# EasyEDA schematic Lightsaber.json
TITLE: Sheet_1; REV: 1.0; Date: 2024-11-18; Sheet: 1/1; Company: Your Company
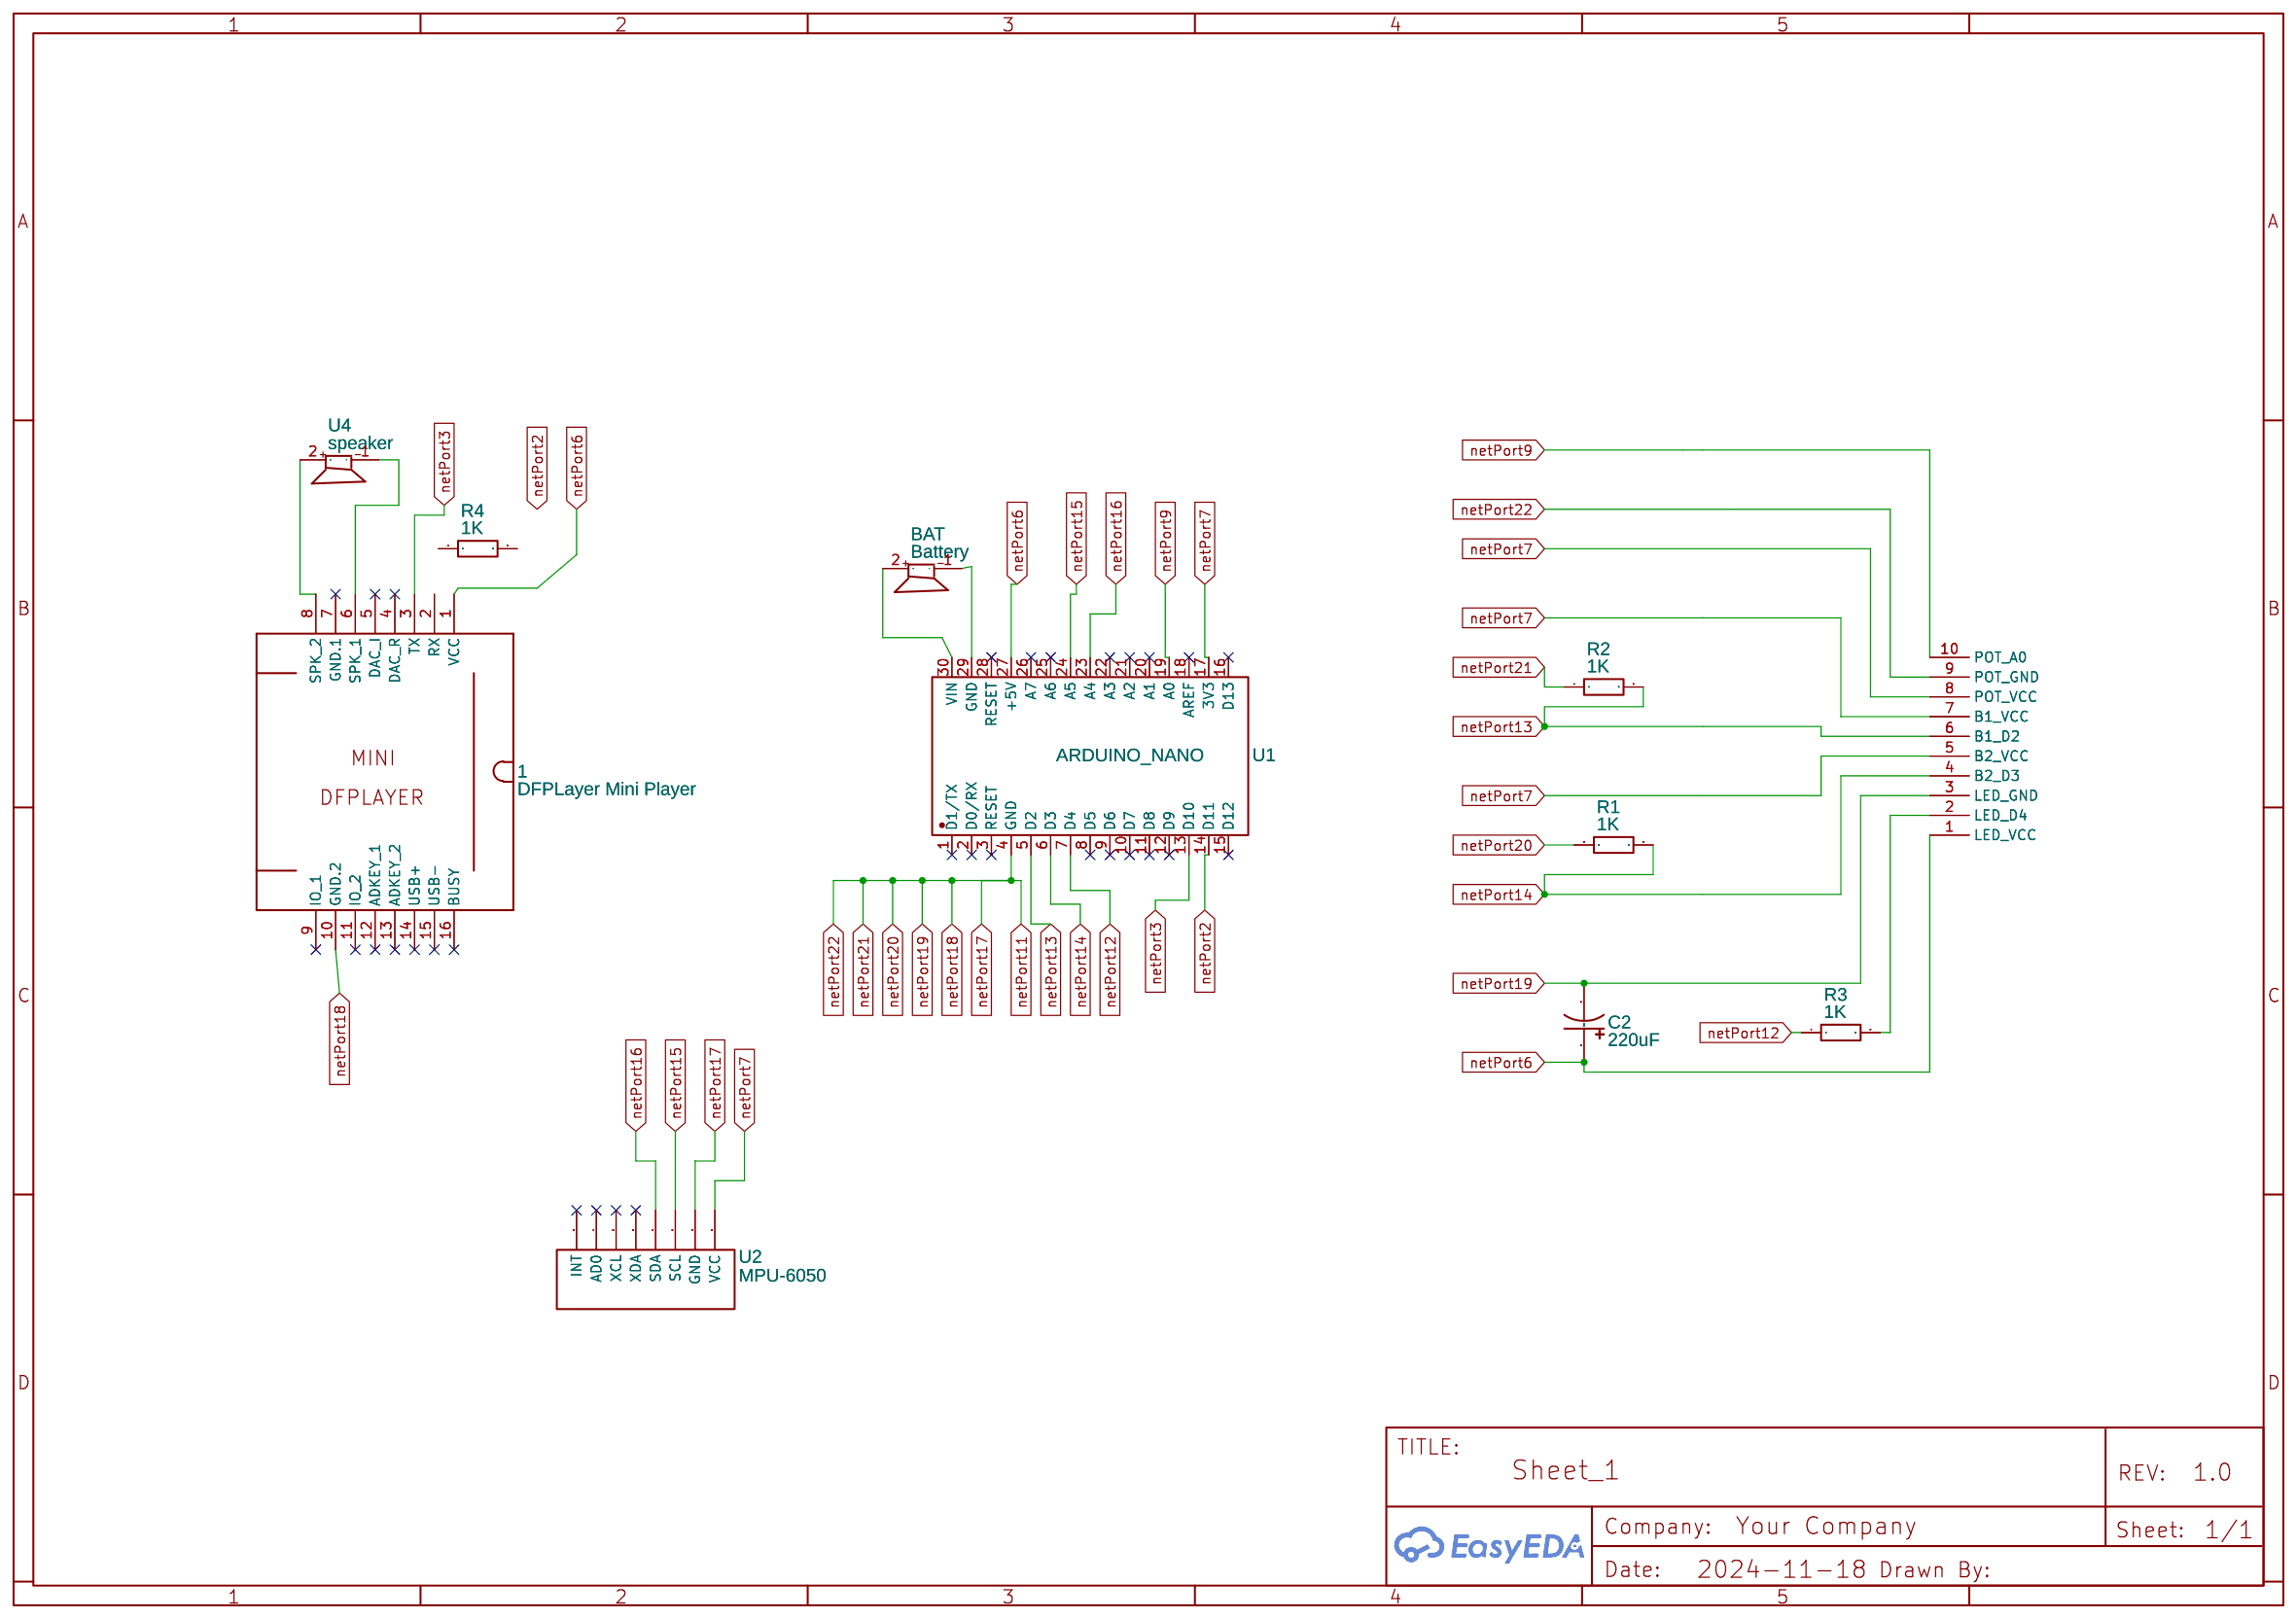
[diagram p0: schematic sheet]

## Parts
1  DFPLayer Mini Player  [DFPLAYER-MINI-MODULE]
BAT  Battery  [SPEAKER]
C2  220uF  [CAPACITOR 220UF @ 16V]
P1  10 pins  [10PINS]
R1  1K  [REZISTOR-0.125_WT_K]
R2  1K  [REZISTOR-0.125_WT_K]
R3  1K  [REZISTOR-0.125_WT_K]
R4  1K  [REZISTOR-0.125_WT_K]
U1  ARDUINO_NANO  [COMM-TH_ARDUINO_NANO]
U2  MPU-6050  [MPU-6050]
U4  speaker  [SPEAKER]

## Library data of the parts
1 = DFPLayer Mini Player: Contributor: santer-88; Supplier: DFPlayer; Supplier Part: DFPlayer; Manufacturer: DFP
BAT U4 = speaker: Contributor: daphnequinonesladroma
C2 = capacitor 220uF @ 16V: Contributor: jorgeca
P1 = 10 pins: Manufacturer Part: New SchematicLib; Contributor: lichat
R1-R4 = 0.125Wt_d: Manufacturer Part: 0.125Wt_k; Supplier Part: undefined; Contributor: titusmarin
U1 = ARDUINO_NANO: Contributor: lcsc; Supplier: LCSC; Supplier Part: C9900017879; Manufacturer: null; JLCPCB Part Class: Extended Part
U2 = MPU-6050: Supplier Part: undefined; Contributor: Tiago Ferreira

## Nets
netPort2: U1.14(D11)
netPort3: 1.3(TX) U1.13(D10)
netPort6: 1.1(VCC) C2.1 P1.1(LED_VCC) U1.27(+5V)
netPort7: P1.5(B2_VCC) P1.7(B1_VCC) P1.8(POT_VCC) U1.17(3V3) U2.1(VCC)
netPort9: P1.10(POT_A0) U1.19(A0)
netPort11: 1.10(GND.2) C2.2 P1.3(LED_GND) P1.9(POT_GND) R1.1 R2.1 U1.4(GND) U2.2(GND)
netPort12: R3.1 U1.7(D4)
netPort13: P1.6(B1_D2) R2.2 U1.5(D2)
netPort14: P1.4(B2_D3) R1.2 U1.6(D3)
netPort15: U1.24(A5) U2.3(SCL)
netPort16: U1.23(A4) U2.4(SDA)
Net-(1-6): 1.6(SPK_1) U4.1(-)
Net-(1-8): 1.8(SPK_2) U4.2(+)
Net-(BAT-1): BAT.1(-) U1.29(GND)
Net-(BAT-2): BAT.2(+) U1.30(VIN)
Net-(P1-2): P1.2(LED_D4) R3.2

Not connected (* = marked no-connect by the designer): 1 2(RX) 4(DAC_R)* 5(DAC_I)* 7(GND.1)* 9(IO_1)* 11(IO_2)* 12(ADKEY_1)* 13(ADKEY_2)* 14(USB+)* 15(USB-)* 16(BUSY)*; R4 1 2; U1 1(D1/TX)* 2(D0/RX)* 3(RESET)* 8(D5)* 9(D6)* 10(D7)* 11(D8)* 12(D9)* 15(D12)* 16(D13)* 18(AREF)* 20(A1)* 21(A2)* 22(A3)* 25(A6)* 26(A7)* 28(RESET)*; U2 5(XDA)* 6(XCL)* 7(AD0)* 8(INT)*
